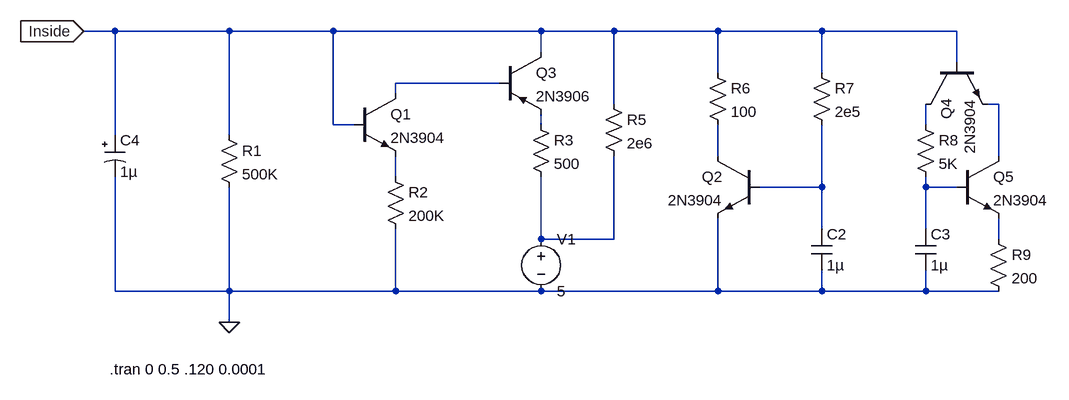
[diagram p0: schematic BurstingNeuron.asc]
BurstingNeuron.asc, the LTspice schematic file:
Version 4
SHEET 1 1408 680
WIRE -32 -80 -80 -80
WIRE 144 -80 -32 -80
WIRE 304 -80 144 -80
WIRE 624 -80 304 -80
WIRE 736 -80 624 -80
WIRE 896 -80 736 -80
WIRE 1056 -80 896 -80
WIRE 1264 -80 1056 -80
WIRE 624 -48 624 -80
WIRE 1264 -32 1264 -80
WIRE 896 -16 896 -80
WIRE 1056 -16 1056 -80
WIRE 560 0 400 0
WIRE 400 16 400 0
WIRE 736 32 736 -80
WIRE 1328 32 1312 32
WIRE 304 64 304 -80
WIRE 336 64 304 64
WIRE 624 64 624 48
WIRE 1216 64 1216 32
WIRE -32 80 -32 -80
WIRE 144 80 144 -80
WIRE 896 112 896 64
WIRE 1328 112 1328 32
WIRE 400 144 400 112
WIRE 1056 160 1056 64
WIRE 1056 160 960 160
WIRE 1216 160 1216 144
WIRE 1264 160 1216 160
WIRE 1056 224 1056 160
WIRE 1216 224 1216 160
WIRE 624 240 624 144
WIRE 736 240 736 112
WIRE 736 240 624 240
WIRE 1328 240 1328 208
WIRE -32 320 -32 144
WIRE 144 320 144 160
WIRE 144 320 -32 320
WIRE 400 320 400 224
WIRE 400 320 144 320
WIRE 624 320 400 320
WIRE 896 320 896 208
WIRE 896 320 624 320
WIRE 1056 320 1056 288
WIRE 1056 320 896 320
WIRE 1216 320 1216 288
WIRE 1216 320 1056 320
WIRE 1328 320 1216 320
WIRE 144 368 144 320
FLAG 144 368 0
FLAG -80 -80 Inside
IOPIN -80 -80 In
SYMBOL res 128 64 R0
SYMATTR InstName R1
SYMATTR Value 500K
SYMBOL npn 336 16 R0
SYMATTR InstName Q1
SYMATTR Value 2N3904
SYMBOL res 384 128 R0
SYMATTR InstName R2
SYMATTR Value 200K
SYMBOL pnp 560 -48 R0
SYMATTR InstName Q3
SYMATTR Value 2N3906
SYMBOL res 608 48 R0
SYMATTR InstName R3
SYMATTR Value 500
SYMBOL voltage 624 224 R0
SYMATTR InstName V1
SYMATTR Value 5
SYMBOL polcap -48 80 R0
SYMATTR InstName C4
SYMATTR Value 1µ
SYMBOL res 720 16 R0
SYMATTR InstName R5
SYMATTR Value 2e6
SYMBOL res 880 -32 R0
SYMATTR InstName R6
SYMATTR Value 100
SYMBOL res 1040 -32 R0
SYMATTR InstName R7
SYMATTR Value 2e5
SYMBOL npn 960 112 M0
SYMATTR InstName Q2
SYMATTR Value 2N3904
SYMBOL cap 1040 224 R0
SYMATTR InstName C2
SYMATTR Value 1µ
SYMBOL npn 1216 -32 M90
SYMATTR InstName Q4
SYMATTR Value 2N3904
SYMBOL npn 1264 112 R0
SYMATTR InstName Q5
SYMATTR Value 2N3904
SYMBOL res 1200 48 R0
SYMATTR InstName R8
SYMATTR Value 5K
SYMBOL res 1312 224 R0
SYMATTR InstName R9
SYMATTR Value 200
SYMBOL cap 1200 224 R0
SYMATTR InstName C3
SYMATTR Value 1µ
TEXT -40 440 Left 2 !.tran 0 0.5 .120 0.0001

The netlist it stands for:
* BurstingNeuron.asc
R1 Inside 0 500K
Q1 N001 Inside N006 0 2N3904
R2 N006 0 200K
Q3 Inside N001 N003 0 2N3906
R3 N003 N009 500
V1 N009 0 5
C4 Inside 0 1µ
R5 Inside N009 2e6
R6 Inside N005 100
R7 Inside N007 2e5
Q2 N005 N007 0 0 2N3904
C2 N007 0 1µ
Q4 N004 Inside N002 0 2N3904
Q5 N002 N008 N010 0 2N3904
R8 N004 N008 5K
R9 N010 0 200
C3 N008 0 1µ
.model NPN NPN
.model PNP PNP
.lib standard.bjt
.tran 0 0.5 .120 0.0001
.backanno
.end